# EAGLE design Sensor_Board_0x09_Prototyping_v1 (EAGLE 8.1.1)
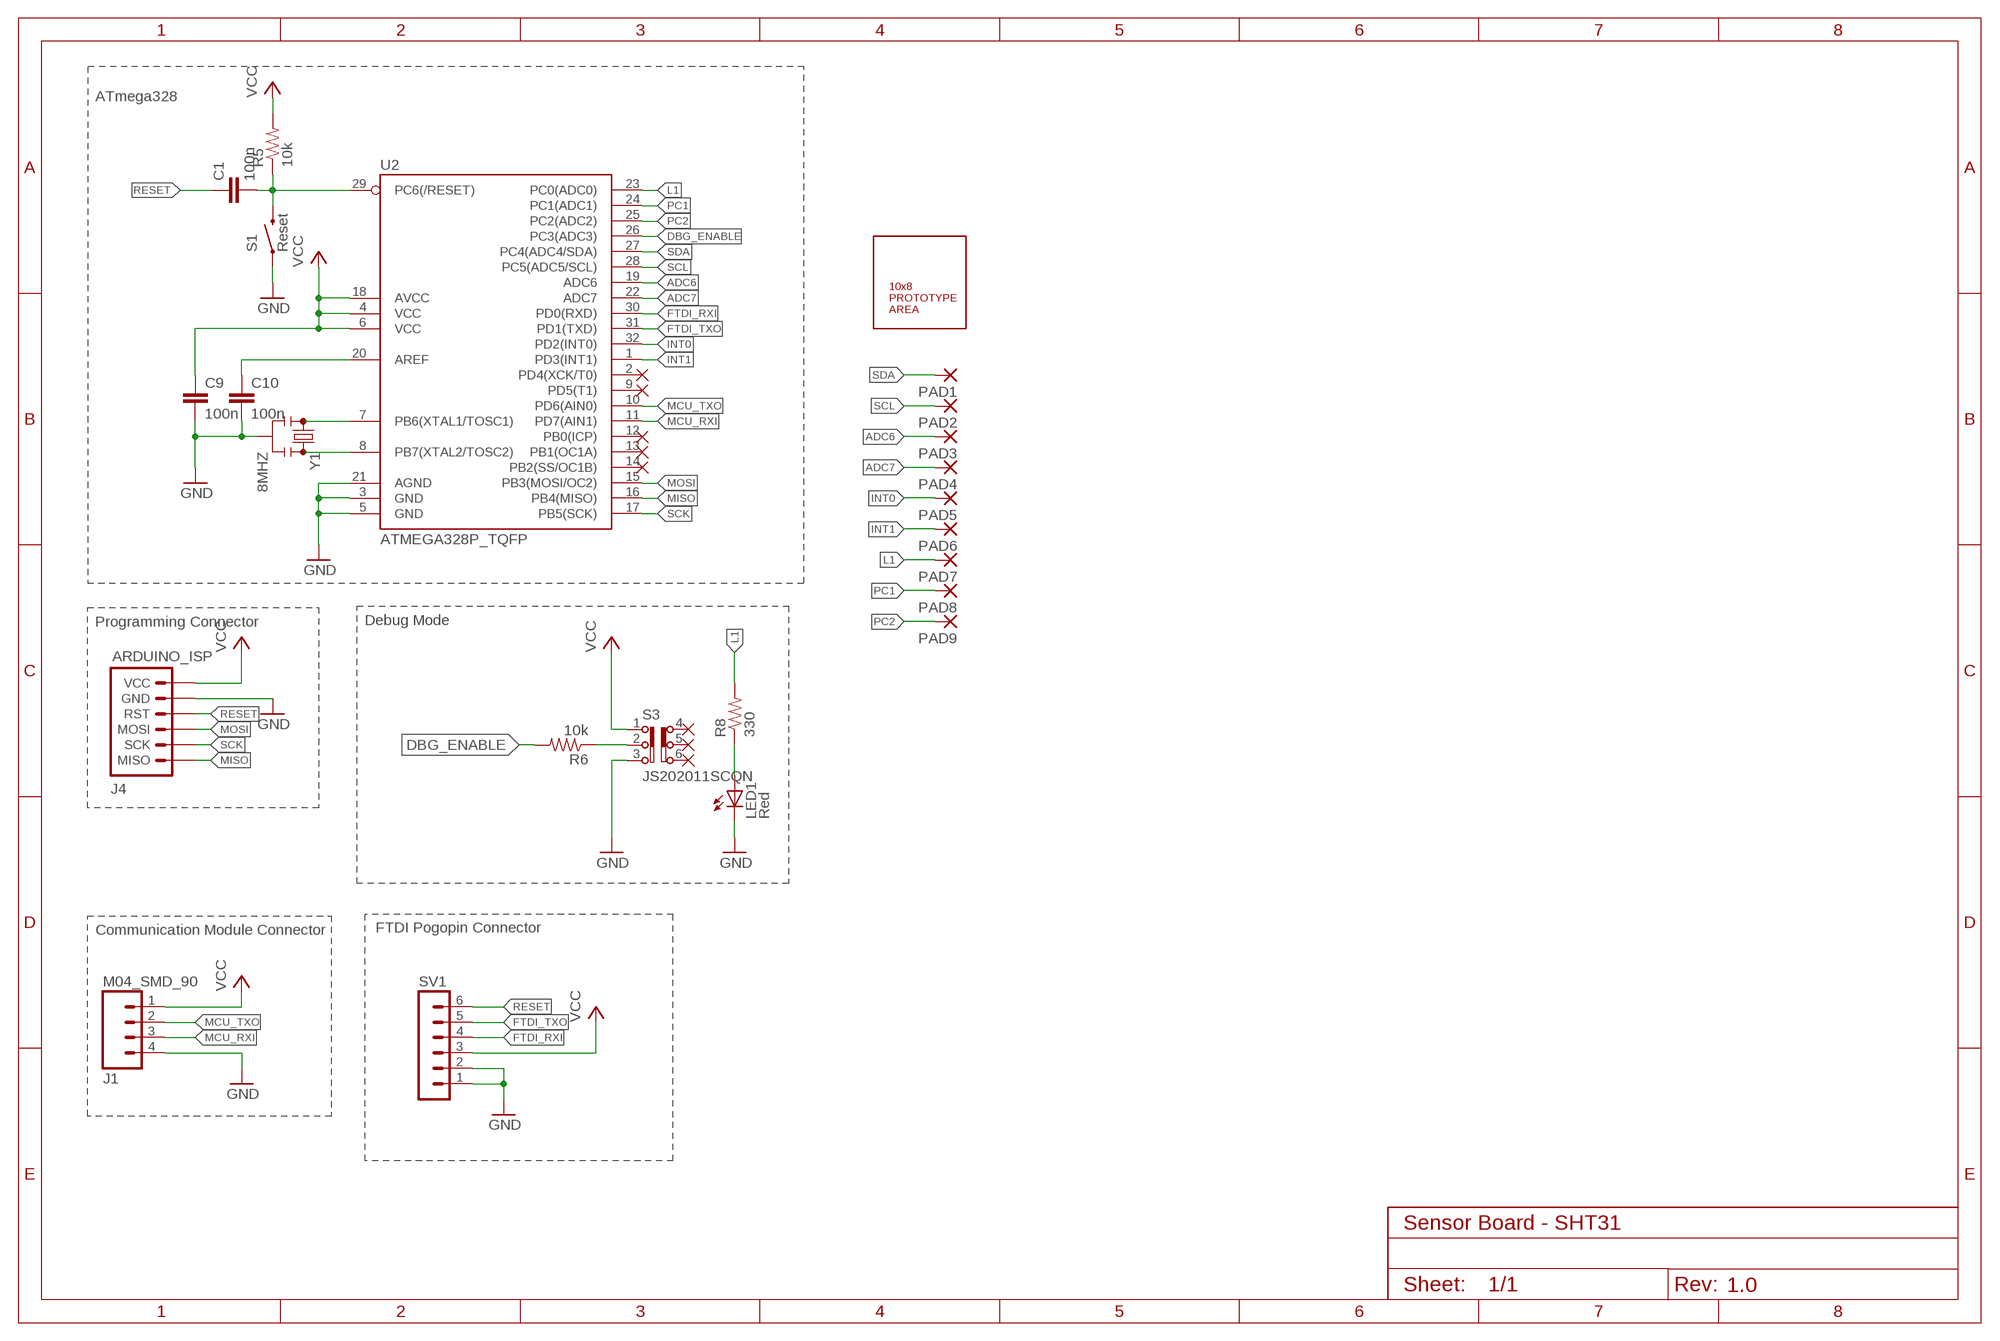
[diagram p0: schematic, sheet 1]
FRAME1 (FRAME-A4L): CNAME: Communication Module; CREVISION: 2.0

## Parts
C1  100n  C  [C0805]
C9  100n  C  [C0805]
C10  100n  C  [C0805]
J1  M04_SMD_90  [M04_SMD_90]
J4  ARDUINO_ISP  [M-2X3]
LED1  Red  LEDSML0805  [SML0805]
PAD1  1,6/0,9  [1,6/0,9]
PAD2  1,6/0,9  [1,6/0,9]
PAD3  1,6/0,9  [1,6/0,9]
PAD4  1,6/0,9  [1,6/0,9]
PAD5  1,6/0,9  [1,6/0,9]
PAD6  1,6/0,9  [1,6/0,9]
PAD7  1,6/0,9  [1,6/0,9]
PAD8  1,6/0,9  [1,6/0,9]
PAD9  1,6/0,9  [1,6/0,9]
R5  10k  RESISTOR0805-RES  [0805]
R6  10k  RESISTOR0805-RES  [0805]
R8  330  RESISTOR0805-RES  [0805]
S1  Reset  PUSHBUTTON  [M-PUSHBUTTON-SMD]
S3  JS202011SCQN  [JS202011SCQN]
SV1  MA06-1  [MA06-1]
U2  ATMEGA328P_TQFP  [TQFP32-08]
U$1  10X8_PROTOTYPE_AREA  [10X8_PROTOTYPE_AREA]
Y1  8MHZ  RESONATOR8MHZ  [RESONATOR-SMD]

## Nets
ADC6: PAD3.1(P) U2.19(ADC6)
ADC7: PAD4.1(P) U2.22(ADC7)
DBG_ENABLE: R6.2 U2.26(PC3(ADC3))
FTDI_RXI: SV1.4 U2.30(PD0(RXD))
FTDI_TXO: SV1.5 U2.31(PD1(TXD))
GND [GND]: C9.2 C10.2 J1.4 J4.P$5(GND) LED1.C S1.1(LEFT) S1.2(LEFT) S3.3 SV1.1 SV1.2 U2.3(GND) U2.5(GND) U2.21(AGND) Y1.2
INT0: PAD5.1(P) U2.32(PD2(INT0))
INT1: PAD6.1(P) U2.1(PD3(INT1))
L1: PAD7.1(P) R8.2 U2.23(PC0(ADC0))
MCU_RXI: J1.3 U2.11(PD7(AIN1))
MCU_TXO: J1.2 U2.10(PD6(AIN0))
MISO: J4.P$1(MISO) U2.16(PB4(MISO))
MOSI: J4.P$3(MOSI) U2.15(PB3(MOSI/OC2))
N$1: U2.8(PB7(XTAL2/TOSC2)) Y1.3
N$2: U2.7(PB6(XTAL1/TOSC1)) Y1.1
N$3: R6.1 S3.2
N$4: C1.2 R5.1 S1.3(RIGHT) S1.4(RIGHT) U2.29(PC6(/RESET))
N$15: C10.1 U2.20(AREF)
N$30: LED1.A R8.1
PC1: PAD8.1(P) U2.24(PC1(ADC1))
PC2: PAD9.1(P) U2.25(PC2(ADC2))
RESET: C1.1 J4.P$4(RST) SV1.6
SCK: J4.P$2(SCK) U2.17(PB5(SCK))
SCL: PAD2.1(P) U2.28(PC5(ADC5/SCL))
SDA: PAD1.1(P) U2.27(PC4(ADC4/SDA))
VCC [Vsupply]: C9.1 J1.1 J4.P$6(VCC) R5.2 S3.1 SV1.3 U2.4(VCC) U2.6(VCC) U2.18(AVCC)
Unconnected: S3.4 S3.5 S3.6 U2.2(PD4(XCK/T0)) U2.9(PD5(T1)) U2.12(PB0(ICP)) U2.13(PB1(OC1A)) U2.14(PB2(SS/OC1B))

## Notes on the sheet
- ATmega328
- Programming Connector | Debug Mode
- Communication Module Connector | FTDI Pogopin Connector
- Sensor Board - SHT31
- 1.0

## Library data of the parts
C1 C9 C10 = eagle-ltspice:C: CAPACITOR, European symbol; SPICEMODEL: NONE; SPICEPREFIX: C
J1 = myownthings:M04_SMD_90
J4 = marc_library:ARDUINO_ISP: AVR ISP 6-pin inline header for Arduino ISP
LED1 = led:LED: LED OSRAM: - CHIPLED LG R971, LG N971, LY N971, LG Q971, LY Q971, LO R971, LY R971 LH N974, LH R974 LS Q976, LO Q976, LY Q976 LO Q996 - Hyper CHIPLED LW Q18S LB Q993, LB Q99A, LB R99A - SideLED LS A670, LO A670, LY A670, LG A670, LP A670 LB A673, LV A673, LT A673, LW A673 LH A674 LY A675 LS A676, LA A676, LO A676, LY A676, LW A676 LS A679, LY A679, LG A679 - Hyper Micro SIDELED® LS Y876, LA Y876, LO Y876, LY Y876 LT Y87S - SmartLED LW L88C, LW L88S LB L89C, LB L89S, LG L890 LS L89K, LO L89K, LY L89K LS L896, LA L896, LO L896, LY L896 - TOPLED LS T670, LO T670, LY T670, LG T670, LP T670 LSG T670, LSP T670, LSY T670, LOP T670, LYG T670 LG T671, LOG T671, LSG T671 LB T673, LV T673, LT T673, LW T673 LH T674 LS T676, LA T676, LO T676, LY T676, LB T676, LH T676, LSB T676, LW T676 LB T67C, LV T67C, LT T67C, LS T67K, LO T67K, LY T67K, LW E67C LS E67B, LA E67B, LO E67B, LY E67B, LB E67C, LV E67C, LT E67C LW T67C LS T679, LY T679, LG T679 LS T770, LO T770, LY T770, LG T770, LP T770 LB T773, LV T773, LT T773, LW T773 LH T774 LS E675, LA E675, LY E675, LS T675 LS T776, LA T776, LO T776, LY T776, LB T776 LHGB T686 LT T68C, LB T68C - Hyper Mini TOPLED® LB M676 - Mini TOPLED Santana® LG M470 LS M47K, LO M47K, LY M47K Source: http://www.osram.convergy.de LUXEON: - LUMILED® LXK2-PW12-R00, LXK2-PW12-S00, LXK2-PW14-U00, LXK2-PW14-V00 LXK2-PM12-R00, LXK2-PM12-S00, LXK2-PM14-U00 LXK2-PE12-Q00, LXK2-PE12-R00, LXK2-PE12-S00, LXK2-PE14-T00, LXK2-PE14-U00 LXK2-PB12-K00, LXK2-PB12-L00, LXK2-PB12-M00, LXK2-PB14-N00, LXK2-PB14-P00, LXK2-PB14-Q00 LXK2-PR12-L00, LXK2-PR12-M00, LXK2-PR14-Q00, LXK2-PR14-R00 LXK2-PD12-Q00, LXK2-PD12-R00, LXK2-PD12-S00 LXK2-PH12-R00, LXK2-PH12-S00 LXK2-PL12-P00, LXK2-PL12-Q00, LXK2-PL12-R00 Source: www.luxeon.com KINGBRIGHT: KA-3528ASYC Source: www.kingbright.com
PAD1-PAD9 = wirepad:1,6/0,9: THROUGH-HOLE PAD
R5 R6 R8 = SparkFun-Passives:RESISTOR: Resistor Basic schematic elements and footprints for 0603, 1206, and PTH resistors.
S1 = marc_library:PUSHBUTTON
S3 = myownthings:JS202011SCQN: DPDT SLIDE SWITCH
SV1 = con-lstb:MA06-1: PIN HEADER; OC_FARNELL: unknown; OC_NEWARK: unknown
U2 = marc_library:ATMEGA328P_TQFP; PROD_ID: IC-09069
U$1 = myownthings:10X8_PROTOTYPE_AREA
Y1 = marc_library:RESONATOR: Resonator Small SMD resonator. Used, eg, on the Arduino Pro/ Pro Mini boards. 8MHz- XTAL-08895 16MHz- XTAL-08900; PROD_ID: XTAL-08895

## Net classes
0 default: width 0.3 mm
1 Vsupply: width 0.5 mm
5 GND: width 0.5 mm

## Board
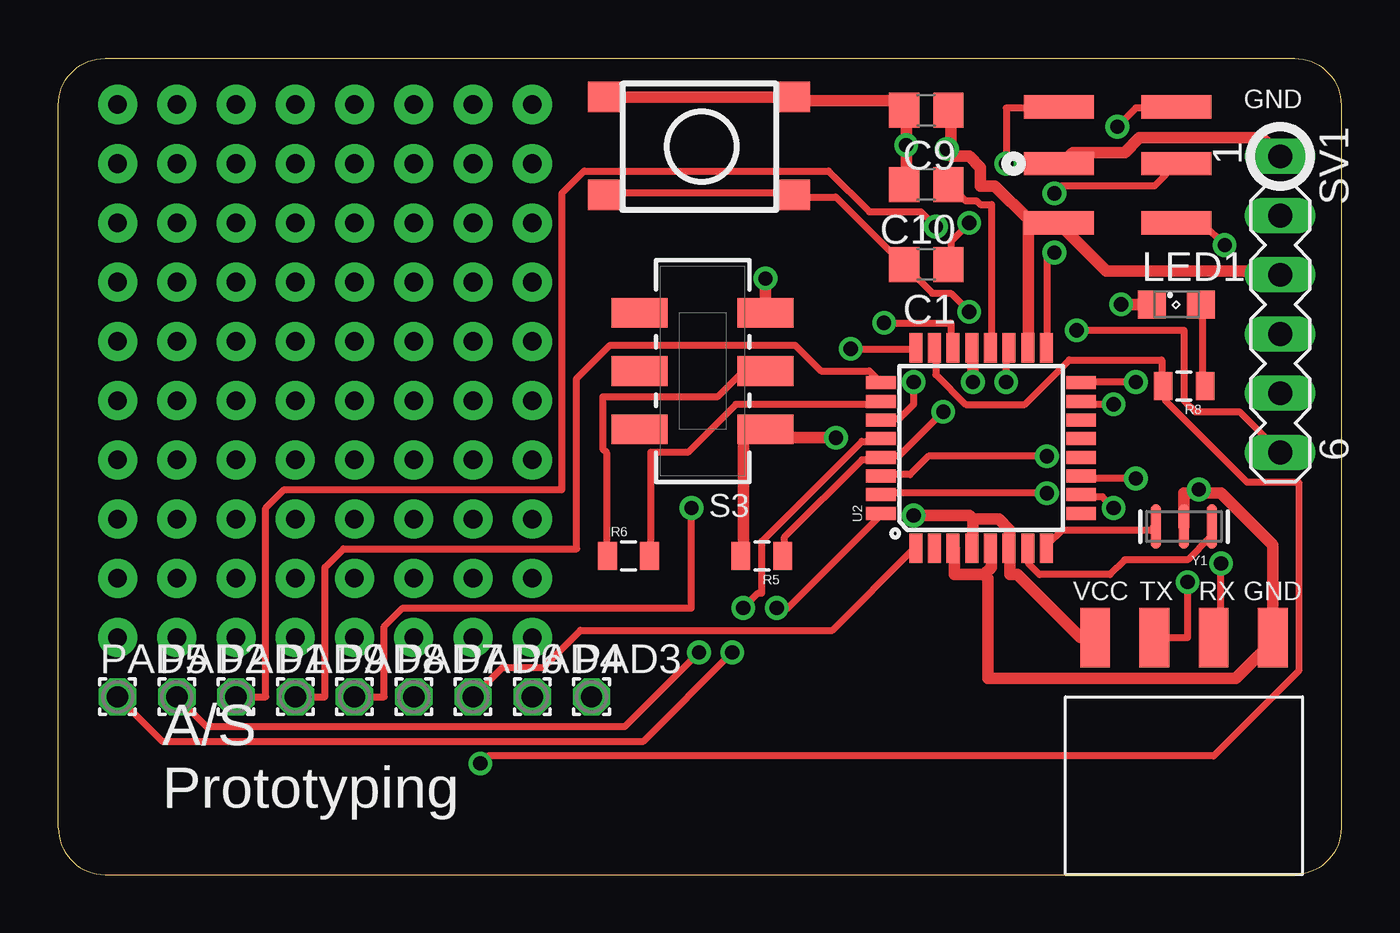
[diagram p1: board, top side]
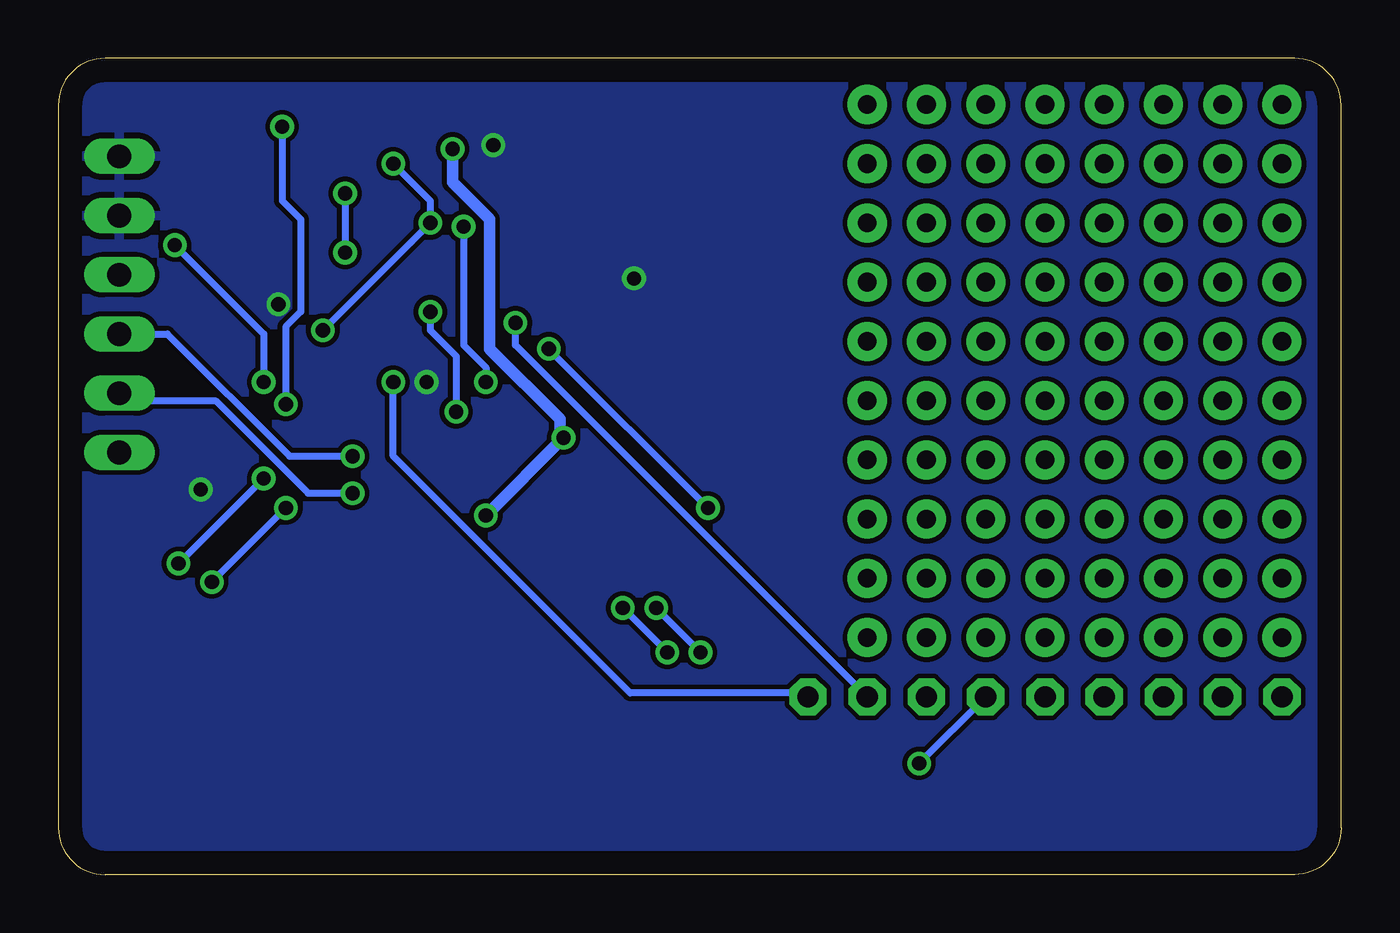
[diagram p2: board, bottom side, seen from below]

Size 55 x 35 mm. Coordinates in mm from the lower left corner, seen from the top.
Outline: 55,33 55,2 arc-90 53,0 2,0 arc-90 0,2 0,33 arc-90 2,35 53,35 arc-90 55,33
Copper layers (1*16): Top 0.035mm / dielectric 1.5mm / Bottom 0.035mm
Design rules "default": minimum track width 10mil, minimum drill 24mil, track to track 8mil, track to pad 8mil, pad to pad 8mil, via to via 8mil, smd to smd 8mil, copper to edge 40mil, drill to drill 8mil, minimum pad ring 10mil, minimum via ring 8mil, stop-mask expansion 4mil, vias tented up to drill 0mil, thermal gap 10mil

### Footprints (pad centres in the part's own frame; a part is rotated, then mirrored left to right if it is on the bottom)
C0805 = smd 1.3 x 1.5: 1 -0.95,0; 2 0.95,0
M04_SMD_90 = smd 1.27 x 2.54: 1 0,0; 2 2.54,0; 3 5.08,0; 4 7.62,0
M-2X3 = smd 1 x 3: P$1 0,0; P$2 2.54,0; P$3 4.98,0; P$4 4.98,5.05; P$5 2.54,5.05; P$6 0,5.05
SML0805 = smd 1.2 x 1.2: A 1.05,0; C -1.05,0
1,6/0,9 = drill 0.914 pad 1.6 octagon: 1 0,0
0805 = smd 0.8 x 1.2: 1 -0.9,0; 2 0.9,0
M-PUSHBUTTON-SMD = smd 1.55 x 1.3: 1 0,0; 2 7.95,0; 3 0,-4.2; 4 7.95,-4.2
JS202011SCQN = smd 1.27 x 2.4: 1 -2.5,-2.7; 2 0,-2.7; 3 2.5,-2.7; 4 -2.5,2.7; 5 0,2.7; 6 2.5,2.7
MA06-1 = drill 1.016 long: 1 -6.35,0; 2 -3.81,0; 3 -1.27,0; 4 1.27,0; 5 3.81,0; 6 6.35,0
TQFP32-08 = smd 1.27 x 0.559: 1 -4.293,2.8; 2 -4.293,2; 3 -4.293,1.2; 4 -4.293,0.4; 5 -4.293,-0.4; 6 -4.293,-1.2; 7 -4.293,-2; 8 -4.293,-2.8; 17 4.293,-2.8; 18 4.293,-2; 19 4.293,-1.2; 20 4.293,-0.4; 21 4.293,0.4; 22 4.293,1.2; 23 4.293,2; 24 4.293,2.8 | smd 0.559 x 1.27: 9 -2.8,-4.293; 10 -2,-4.293; 11 -1.2,-4.293; 12 -0.4,-4.293; 13 0.4,-4.293; 14 1.2,-4.293; 15 2,-4.293; 16 2.8,-4.293; 25 2.8,4.293; 26 2,4.293; 27 1.2,4.293; 28 0.4,4.293; 29 -0.4,4.293; 30 -1.2,4.293; 31 -2,4.293; 32 -2.8,4.293
10X8_PROTOTYPE_AREA = drill 0.8 pad 1.676: P$1 0,0; P$2 2.54,0; P$3 5.08,0; P$4 7.62,0; P$5 10.16,0; P$6 12.7,0; P$7 15.24,0; P$8 17.78,0; P$9 0,-2.54; P$10 2.54,-2.54; P$11 5.08,-2.54; P$12 7.62,-2.54; P$13 10.16,-2.54; P$14 12.7,-2.54; P$15 15.24,-2.54; P$16 17.78,-2.54; P$17 0,-5.08; P$18 2.54,-5.08; P$19 5.08,-5.08; P$20 7.62,-5.08; P$21 10.16,-5.08; P$22 12.7,-5.08; P$23 15.24,-5.08; P$24 17.78,-5.08; P$25 0,-7.62; P$26 2.54,-7.62; P$27 5.08,-7.62; P$28 7.62,-7.62; P$29 10.16,-7.62; P$30 12.7,-7.62; P$31 15.24,-7.62; P$32 17.78,-7.62; P$33 0,-10.16; P$34 2.54,-10.16; P$35 5.08,-10.16; P$36 7.62,-10.16; P$37 10.16,-10.16; P$38 12.7,-10.16; P$39 15.24,-10.16; P$40 17.78,-10.16; P$41 0,-12.7; P$42 2.54,-12.7; P$43 5.08,-12.7; P$44 7.62,-12.7; P$45 10.16,-12.7; P$46 12.7,-12.7; P$47 15.24,-12.7; P$48 17.78,-12.7; P$49 0,-15.24; P$50 2.54,-15.24; P$51 5.08,-15.24; P$52 7.62,-15.24; P$53 10.16,-15.24; P$54 12.7,-15.24; P$55 15.24,-15.24; P$56 17.78,-15.24; P$57 0,-17.78; P$58 2.54,-17.78; P$59 5.08,-17.78; P$60 7.62,-17.78; P$61 10.16,-17.78; P$62 12.7,-17.78; P$63 15.24,-17.78; P$64 17.78,-17.78; P$65 0,-20.32; P$66 2.54,-20.32; P$67 5.08,-20.32; P$68 7.62,-20.32; P$69 10.16,-20.32; P$70 12.7,-20.32; P$71 15.24,-20.32; P$72 17.78,-20.32; P$73 0,-22.86; P$74 2.54,-22.86; P$75 5.08,-22.86; P$76 7.62,-22.86; P$77 10.16,-22.86; P$78 12.7,-22.86; P$79 15.24,-22.86; P$80 17.78,-22.86
RESONATOR-SMD = smd 0.45 x 1.905: 1 -1.2,0; 2 0,0; 3 1.2,0

### Placement (x,y rotation side)
C1  37.21,26.16 180 top
C9  37.21,32.77 180 top
C10  37.21,29.59 180 top
J1  44.45,10.16 0 top
J4  47.94,27.94 90 top
LED1  47.94,24.45 0 top
PAD1  7.62,7.62 0 top
PAD2  5.08,7.62 0 top
PAD3  22.86,7.62 0 top
PAD4  20.32,7.62 0 top
PAD5  2.54,7.62 0 top
PAD6  17.78,7.62 0 top
PAD7  15.24,7.62 0 top
PAD8  12.7,7.62 0 top
PAD9  10.16,7.62 0 top
R5  30.16,13.65 180 top
R6  24.45,13.65 0 top
R8  48.26,20.95 180 top
S1  23.5,33.34 0 top
S3  27.62,21.59 90 top
SV1  52.39,24.45 270 top
U2  39.56,18.29 90 top
U$1  2.54,33.02 0 top
Y1  48.26,14.92 180 top

### Tracks (layer width: path | path; a pad name or v marks a point on that pad's centre or on a via)
ADC6  (via drill 0.61)
  Top 0.3: v40.64,21.11 40.64,22.54 U2.19
  Bottom 0.3: v40.64,21.11 40.64,17.94 30.48,7.78 23.02,7.78 PAD3.1
ADC7  (via drill 0.61)
  Top 0.3: v35.4,23.65 38.26,23.65 38.26,22.7 U2.22
  Bottom 0.3: v35.4,23.65 35.4,22.7 PAD4.1
DBG_ENABLE
  Top 0.3: R6.2 25.4,13.65 25.4,18.1 26.99,18.1 29.05,20.16 35.24,20.16 U2.26
FTDI_RXI  (via drill 0.61)
  Top 0.3: v42.39,17.94 37.31,17.94 36.51,17.14 35.4,17.14 U2.30
  Bottom 0.3: v42.39,17.94 45.09,17.94 50.32,23.18 SV1.4
FTDI_TXO  (via drill 0.61)
  Top 0.3: v42.39,16.35 35.4,16.35 U2.31
  Bottom 0.3: v42.39,16.35 44.29,16.35 48.26,20.32 52.07,20.32 SV1.5
GND  (via drill 0.61)
  Top 0.5: 39.69,12.86 38.42,12.86 38.42,13.97 U2.3 | 39.69,12.86 40.01,13.18 40.01,13.97 U2.5 | Y1.2 48.26,16.35 48.9,16.35 | 48.9,16.35 49.85,16.35 52.07,14.13 J1.4 52.07,10 50.48,8.41 39.85,8.41 39.85,12.7 39.69,12.86 | C10.2 36.35,29.69 v36.35,31.27 36.35,32.7 C9.2 36.04,32.86 35.72,33.18 31.59,33.18 S1.2 S1.1 | v45.56,24.45 LED1.C | v39.21,21.11 39.21,22.54 U2.21 | v30.32,25.56 30.32,24.13 S3.3 | SV1.1 51.59,31.59 46.35,31.59 45.72,30.96 43.5,30.96 43.02,30.48 J4.P$5 | v48.9,16.51 48.9,16.35
  pour Bottom: 55,33 55,2 arc-90 53,0 2,0 arc-90 0,2 0,33 arc-90 2,35 53,35 arc-90
INT0  (via drill 0.61)
  Top 0.3: v30.8,11.43 31.27,11.43 35.24,15.4 U2.32 | v28.89,9.53 25.08,5.71 4.45,5.71 PAD5.1
  Bottom 0.3: v28.89,9.53 v30.8,11.43
INT1
  Top 0.3: PAD6.1 19.05,8.89 20.8,8.89 22.38,10.48 33.18,10.48 36.67,13.97 U2.1
L1  (via drill 0.61)
  Top 0.3: U2.23 37.62,22.54 37.62,21.43 38.89,20.16 41.43,20.16 43.34,22.07 47.31,22.07 47.31,20.95 R8.2 47.47,20.95 47.47,20.32 50.96,16.83 53.18,16.83 53.18,8.73 49.53,5.08 18.41,5.08 v18.1,4.76
  Bottom 0.3: v18.1,4.76 PAD7.1
MCU_RXI  (via drill 0.61)
  Top 0.3: v46.2,16.99 43.97,16.99 U2.11 | v49.85,13.34 49.85,10.16 J1.3
  Bottom 0.3: v49.85,13.34 v46.2,16.99
MCU_TXO  (via drill 0.61)
  Top 0.3: v45.24,15.72 44.77,16.19 43.97,16.19 U2.10 | v48.42,12.54 48.42,10.16 J1.2
  Bottom 0.3: v48.42,12.54 v45.24,15.72
MISO  (via drill 0.61)
  Top 0.3: v46.2,21.11 43.97,21.11 U2.16 | v50.01,26.99 49.05,27.94 J4.P$1
  Bottom 0.3: v46.2,21.11 46.2,23.18 v50.01,26.99
MOSI  (via drill 0.61)
  Top 0.3: v45.24,20.16 43.97,20.16 U2.15 | v45.4,32.07 46.2,32.86 47.94,32.86 J4.P$3
  Bottom 0.3: v45.24,20.16 45.24,23.5 44.61,24.13 44.61,28.1 45.4,28.89 v45.4,32.07
N$1
  Top 0.3: U2.8 42.39,14.13 43.02,14.76 46.83,14.76 46.99,14.92 Y1.3
N$2
  Top 0.3: U2.7 41.59,13.97 41.59,13.34 42.07,12.86 45.09,12.86 45.72,13.49 48.42,13.49 49.37,14.45 49.37,14.92 Y1.1
N$3
  Top 0.3: S3.2 29.37,21.59 28.26,20.48 23.34,20.48 23.34,18.26 23.5,18.1 23.5,13.65 R6.1
N$4  (via drill 0.61)
  Top 0.3: R5.1 31.11,13.65 31.11,14.45 34.45,17.78 35.24,17.78 U2.29 35.4,17.94 36.04,17.94 v37.94,19.84 | S1.3 23.5,29.21 31.43,29.21 S1.4 31.59,29.05 33.34,29.05 36.2,26.19 C1.2 36.35,26.04 37.47,24.92 38.26,24.92 v39.05,24.13
  Bottom 0.3: v37.94,19.84 37.94,22.23 39.05,23.34 v39.05,24.13
N$15
  Top 0.3: U2.20 40.01,22.7 40.01,28.73 39.53,28.73 39.37,28.89 38.89,28.89 38.26,29.53 C10.1
N$30
  Top 0.3: R8.1 49.05,20.95 49.05,24.45 LED1.A
PC1  (via drill 0.61)
  Top 0.3: v33.97,22.54 36.67,22.54 U2.24 | v27.15,15.72 27.15,11.43 14.76,11.43 13.97,10.64 13.97,7.62 PAD8.1
  Bottom 0.3: v27.15,15.72 v33.97,22.54
PC2
  Top 0.3: PAD9.1 11.43,7.62 11.43,13.18 12.22,13.97 22.23,13.97 22.23,21.27 23.65,22.7 31.59,22.7 32.7,21.59 34.77,21.59 35.24,21.11 U2.25
RESET  (via drill 0.61)
  Top 0.3: v39.05,27.94 38.26,27.15 38.26,26.19 C1.1 | v40.64,30.48 40.64,32.86 42.86,32.86 J4.P$4 | SV1.6 50.64,19.84 48.74,19.84 48.26,20.32 48.26,23.34 v43.66,23.34
  Bottom 0.3: v40.64,30.48 39.05,28.89 v39.05,27.94 v43.66,23.34
SCK  (via drill 0.61)
  Top 0.3: v42.7,26.67 42.39,26.67 42.39,22.7 U2.17 | v42.7,29.21 43.02,29.53 46.99,29.53 J4.P$2
  Bottom 0.3: v42.7,29.21 v42.7,26.67
SCL  (via drill 0.61)
  Top 0.3: v29.37,11.43 30,12.06 30.16,12.06 30.16,14.29 34.45,18.57 35.24,18.57 U2.28 | v27.46,9.53 24.29,6.35 6.35,6.35 PAD2.1
  Bottom 0.3: v27.46,9.53 v29.37,11.43
SDA  (via drill 0.61)
  Top 0.3: v36.67,21.11 36.67,20.16 36.04,19.53 35.4,19.53 U2.27 | v37.62,27.78 36.99,28.42 34.77,28.42 33.02,30.16 22.54,30.16 21.59,29.21 21.59,16.51 9.68,16.51 8.89,15.72 8.89,7.62 PAD1.1
  Bottom 0.3: v36.67,21.11 36.67,21.75 37.62,22.7 v37.62,27.78
VCC  (via drill 0.61)
  Top 0.5: J4.P$6 41.59,27.94 41.59,22.7 U2.18 | 38.26,31.11 38.26,30.8 39.05,30.8 39.53,30.32 39.53,29.53 40.16,29.53 41.59,28.1 J4.P$6 | 38.26,31.11 38.26,32.7 C9.1 | SV1.3 52.23,25.88 44.93,25.88 43.02,27.78 J4.P$6 | R5.2 29.37,13.65 29.37,19.05 30.32,19.05 S3.1 30.48,18.89 30.64,18.73 v33.34,18.73 | 39.21,15.24 39.21,14.13 U2.4 | 39.21,15.24 40.32,15.24 40.8,14.76 40.8,14.13 U2.6 40.8,13.81 40.8,12.86 41.12,12.86 43.81,10.16 J1.1 | v36.67,15.4 39.05,15.4 39.21,15.24 | v38.1,31.11 38.26,31.11
  Bottom 0.5: v36.67,15.4 v33.34,18.73 33.5,18.89 33.5,19.53 36.51,22.54 36.51,28.1 38.1,29.69 v38.1,31.11

### Text on the board
tPlace: GND | VCC | TX | RX | GND | A/S / Prototyping